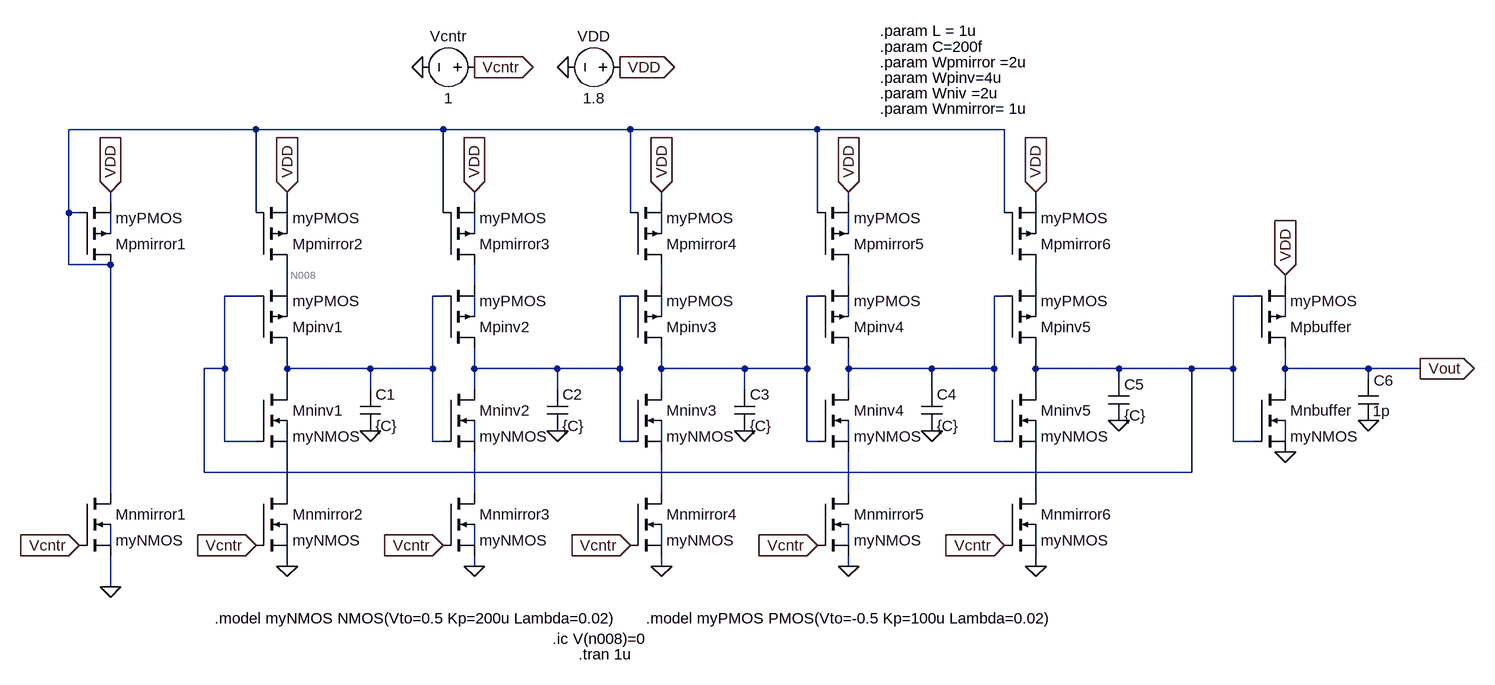
[diagram p0: schematic CMOS_Current-Starved_Voltage-Controlled_Oscillator_(VCO).asc]
CMOS_Current-Starved_Voltage-Controlled_Oscillator_(VCO).asc, the LTspice schematic file:
Version 4.1
SHEET 1 3616 680
WIRE 1712 -400 1424 -400
WIRE 2000 -400 1712 -400
WIRE 2288 -400 2000 -400
WIRE 2576 -400 2288 -400
WIRE 2864 -400 2576 -400
WIRE 1488 -288 1488 -304
WIRE 1760 -288 1760 -304
WIRE 2048 -288 2048 -304
WIRE 2336 -288 2336 -304
WIRE 2624 -288 2624 -304
WIRE 2912 -288 2912 -304
WIRE 1424 -272 1424 -400
WIRE 1440 -272 1424 -272
WIRE 1712 -272 1712 -400
WIRE 2000 -272 2000 -400
WIRE 2288 -272 2288 -400
WIRE 2576 -272 2576 -400
WIRE 2864 -272 2864 -400
WIRE 1488 -240 1488 -272
WIRE 1760 -240 1760 -272
WIRE 2048 -240 2048 -272
WIRE 2336 -240 2336 -272
WIRE 2624 -240 2624 -272
WIRE 2912 -240 2912 -272
WIRE 1424 -192 1424 -272
WIRE 1488 -192 1424 -192
WIRE 1760 -160 1760 -192
WIRE 2048 -160 2048 -192
WIRE 2336 -160 2336 -192
WIRE 2624 -160 2624 -192
WIRE 2912 -160 2912 -192
WIRE 3296 -160 3296 -176
WIRE 1712 -144 1664 -144
WIRE 2000 -144 1984 -144
WIRE 2288 -144 2272 -144
WIRE 2576 -144 2560 -144
WIRE 2864 -144 2848 -144
WIRE 3248 -144 3216 -144
WIRE 1760 -112 1760 -144
WIRE 2048 -112 2048 -144
WIRE 2336 -112 2336 -144
WIRE 2624 -112 2624 -144
WIRE 2912 -112 2912 -144
WIRE 3296 -112 3296 -144
WIRE 1664 -32 1664 -144
WIRE 1664 -32 1632 -32
WIRE 1760 -32 1760 -64
WIRE 1888 -32 1760 -32
WIRE 1984 -32 1984 -144
WIRE 1984 -32 1888 -32
WIRE 2048 -32 2048 -64
WIRE 2176 -32 2048 -32
WIRE 2272 -32 2272 -144
WIRE 2272 -32 2176 -32
WIRE 2336 -32 2336 -64
WIRE 2464 -32 2336 -32
WIRE 2560 -32 2560 -144
WIRE 2560 -32 2464 -32
WIRE 2624 -32 2624 -64
WIRE 2752 -32 2624 -32
WIRE 2848 -32 2848 -144
WIRE 2848 -32 2752 -32
WIRE 2912 -32 2912 -64
WIRE 3040 -32 2912 -32
WIRE 3152 -32 3040 -32
WIRE 3216 -32 3216 -144
WIRE 3216 -32 3152 -32
WIRE 3296 -32 3296 -64
WIRE 3424 -32 3296 -32
WIRE 3504 -32 3424 -32
WIRE 3040 -16 3040 -32
WIRE 3424 -16 3424 -32
WIRE 1760 0 1760 -32
WIRE 1888 0 1888 -32
WIRE 2048 0 2048 -32
WIRE 2176 0 2176 -32
WIRE 2336 0 2336 -32
WIRE 2464 0 2464 -32
WIRE 2624 0 2624 -32
WIRE 2752 0 2752 -32
WIRE 2912 0 2912 -32
WIRE 3296 0 3296 -32
WIRE 1664 80 1664 -32
WIRE 1712 80 1664 80
WIRE 1760 80 1760 48
WIRE 1984 80 1984 -32
WIRE 2000 80 1984 80
WIRE 2048 80 2048 48
WIRE 2272 80 2272 -32
WIRE 2288 80 2272 80
WIRE 2336 80 2336 48
WIRE 2560 80 2560 -32
WIRE 2576 80 2560 80
WIRE 2624 80 2624 48
WIRE 2848 80 2848 -32
WIRE 2864 80 2848 80
WIRE 2912 80 2912 48
WIRE 3216 80 3216 -32
WIRE 3248 80 3216 80
WIRE 3296 80 3296 48
WIRE 1632 128 1632 -32
WIRE 3152 128 3152 -32
WIRE 3152 128 1632 128
WIRE 1488 160 1488 -192
WIRE 1760 160 1760 96
WIRE 2048 160 2048 96
WIRE 2336 160 2336 96
WIRE 2624 160 2624 96
WIRE 2912 160 2912 96
WIRE 1488 240 1488 208
WIRE 1760 240 1760 208
WIRE 2048 240 2048 208
WIRE 2336 240 2336 208
WIRE 2624 240 2624 208
WIRE 2912 240 2912 208
WIRE 1760 272 1760 256
WIRE 2048 272 2048 256
WIRE 2336 272 2336 256
WIRE 2624 272 2624 256
WIRE 2912 272 2912 256
WIRE 1488 304 1488 256
FLAG 2192 -496 0
FLAG 2272 -496 VDD
IOPIN 2272 -496 Out
FLAG 1760 272 0
FLAG 1488 304 0
FLAG 1488 -304 VDD
IOPIN 1488 -304 In
FLAG 1760 -304 VDD
IOPIN 1760 -304 In
FLAG 1888 64 0
FLAG 1968 -496 0
FLAG 2048 -496 Vcntr
IOPIN 2048 -496 Out
FLAG 1440 240 Vcntr
IOPIN 1440 240 In
FLAG 1712 240 Vcntr
IOPIN 1712 240 In
FLAG 2048 -304 VDD
IOPIN 2048 -304 In
FLAG 2048 272 0
FLAG 2000 240 Vcntr
IOPIN 2000 240 In
FLAG 2176 64 0
FLAG 2336 -304 VDD
IOPIN 2336 -304 In
FLAG 2336 272 0
FLAG 2288 240 Vcntr
IOPIN 2288 240 In
FLAG 2464 64 0
FLAG 2624 -304 VDD
IOPIN 2624 -304 In
FLAG 2624 272 0
FLAG 2576 240 Vcntr
IOPIN 2576 240 In
FLAG 2752 64 0
FLAG 2912 -304 VDD
IOPIN 2912 -304 In
FLAG 2912 272 0
FLAG 2864 240 Vcntr
IOPIN 2864 240 In
FLAG 3040 48 0
FLAG 3296 96 0
FLAG 3296 -176 VDD
IOPIN 3296 -176 In
FLAG 3424 48 0
FLAG 3504 -32 Vout
IOPIN 3504 -32 Out
SYMBOL voltage 2288 -496 R90
WINDOW 0 -32 56 VBottom 2
WINDOW 3 32 56 VTop 2
WINDOW 123 0 0 Left 0
WINDOW 39 0 0 Left 0
SYMATTR InstName VDD
SYMATTR Value 1.8
SYMBOL nmos4 1440 160 R0
SYMATTR InstName Mnmirror1
SYMATTR Value myNMOS
SYMATTR Value2 l={L} w={Wnmirror}
SYMBOL pmos4 1440 -192 M180
SYMATTR InstName Mpmirror1
SYMATTR Value myPMOS
SYMATTR Value2 l={L} w={Wpmirror}
SYMBOL pmos4 1712 -192 M180
SYMATTR InstName Mpmirror2
SYMATTR Value myPMOS
SYMATTR Value2 l={L} w={Wpmirror}
SYMBOL pmos4 1712 -64 M180
SYMATTR InstName Mpinv1
SYMATTR Value myPMOS
SYMATTR Value2 l=1u w={Wpinv}
SYMBOL nmos4 1712 0 R0
SYMATTR InstName Mninv1
SYMATTR Value myNMOS
SYMATTR Value2 l=1u w={Wniv}
SYMBOL nmos4 1712 160 R0
SYMATTR InstName Mnmirror2
SYMATTR Value myNMOS
SYMATTR Value2 l={L} w={Wnmirror}
SYMBOL cap 1872 0 R0
SYMATTR InstName C1
SYMATTR Value {C}
SYMBOL voltage 2064 -496 R90
WINDOW 0 -32 56 VBottom 2
WINDOW 3 32 56 VTop 2
WINDOW 123 0 0 Left 0
WINDOW 39 0 0 Left 0
SYMATTR InstName Vcntr
SYMATTR Value 1
SYMBOL pmos4 2000 -64 M180
SYMATTR InstName Mpinv2
SYMATTR Value myPMOS
SYMATTR Value2 l=1u w={Wpinv}
SYMBOL nmos4 2000 0 R0
SYMATTR InstName Mninv2
SYMATTR Value myNMOS
SYMATTR Value2 l=1u w={Wniv}
SYMBOL pmos4 2000 -192 M180
SYMATTR InstName Mpmirror3
SYMATTR Value myPMOS
SYMATTR Value2 l={L} w={Wpmirror}
SYMBOL nmos4 2000 160 R0
SYMATTR InstName Mnmirror3
SYMATTR Value myNMOS
SYMATTR Value2 l={L} w={Wnmirror}
SYMBOL cap 2160 0 R0
SYMATTR InstName C2
SYMATTR Value {C}
SYMBOL pmos4 2288 -64 M180
SYMATTR InstName Mpinv3
SYMATTR Value myPMOS
SYMATTR Value2 l=1u w={Wpinv}
SYMBOL nmos4 2288 0 R0
SYMATTR InstName Mninv3
SYMATTR Value myNMOS
SYMATTR Value2 l=1u w={Wniv}
SYMBOL pmos4 2288 -192 M180
SYMATTR InstName Mpmirror4
SYMATTR Value myPMOS
SYMATTR Value2 l={L} w={Wpmirror}
SYMBOL nmos4 2288 160 R0
SYMATTR InstName Mnmirror4
SYMATTR Value myNMOS
SYMATTR Value2 l={L} w={Wnmirror}
SYMBOL cap 2448 0 R0
SYMATTR InstName C3
SYMATTR Value {C}
SYMBOL pmos4 2576 -64 M180
SYMATTR InstName Mpinv4
SYMATTR Value myPMOS
SYMATTR Value2 l=1u w={Wpinv}
SYMBOL nmos4 2576 0 R0
SYMATTR InstName Mninv4
SYMATTR Value myNMOS
SYMATTR Value2 l=1u w={Wniv}
SYMBOL pmos4 2576 -192 M180
SYMATTR InstName Mpmirror5
SYMATTR Value myPMOS
SYMATTR Value2 l={L} w={Wpmirror}
SYMBOL nmos4 2576 160 R0
SYMATTR InstName Mnmirror5
SYMATTR Value myNMOS
SYMATTR Value2 l={L} w={Wnmirror}
SYMBOL cap 2736 0 R0
SYMATTR InstName C4
SYMATTR Value {C}
SYMBOL pmos4 2864 -64 M180
SYMATTR InstName Mpinv5
SYMATTR Value myPMOS
SYMATTR Value2 l=1u w={Wpinv}
SYMBOL nmos4 2864 0 R0
SYMATTR InstName Mninv5
SYMATTR Value myNMOS
SYMATTR Value2 l=1u w={Wniv}
SYMBOL pmos4 2864 -192 M180
SYMATTR InstName Mpmirror6
SYMATTR Value myPMOS
SYMATTR Value2 l={L} w={Wpmirror}
SYMBOL nmos4 2864 160 R0
SYMATTR InstName Mnmirror6
SYMATTR Value myNMOS
SYMATTR Value2 l={L} w={Wnmirror}
SYMBOL cap 3024 -16 R0
SYMATTR InstName C5
SYMATTR Value {C}
SYMBOL pmos4 3248 -64 M180
SYMATTR InstName Mpbuffer
SYMATTR Value myPMOS
SYMATTR Value2 l=1u w=8u
SYMBOL nmos4 3248 0 R0
SYMATTR InstName Mnbuffer
SYMATTR Value myNMOS
SYMATTR Value2 l=1u w=4u
SYMBOL cap 3408 -16 R0
WINDOW 0 24 2 Left 2
WINDOW 3 23 49 Left 2
SYMATTR InstName C6
SYMATTR Value 1p
TEXT 1648 352 Left 2 !.model myNMOS NMOS(Vto=0.5 Kp=200u Lambda=0.02)
TEXT 2312 352 Left 2 !.model myPMOS PMOS(Vto=-0.5 Kp=100u Lambda=0.02)
TEXT 2208 408 Left 2 !.tran 1u
TEXT 2168 384 Left 2 !.ic V(n008)=0
TEXT 2672 -528 Left 2 !.param C=200f
TEXT 2672 -552 Left 2 !.param L = 1u
TEXT 2672 -456 Left 2 !.param Wniv =2u
TEXT 2672 -432 Left 2 !.param Wnmirror= 1u
TEXT 2672 -504 Left 2 !.param Wpmirror =2u
TEXT 2672 -480 Left 2 !.param Wpinv=4u

The netlist it stands for:
* CMOS_Current-Starved_Voltage-Controlled_Oscillator_(VCO).asc
VDD VDD 0 1.8
Mnmirror1 N001 Vcntr 0 N035 myNMOS l={L} w={Wnmirror}
Mpmirror1 N001 N001 VDD N002 myPMOS l={L} w={Wpmirror}
Mpmirror2 N008 N001 VDD N003 myPMOS l={L} w={Wpmirror}
Mpinv1 N014 N013 N008 N018 myPMOS l=1u w={Wpinv}
Mninv1 N014 N013 N030 N024 myNMOS l=1u w={Wniv}
Mnmirror2 N030 Vcntr 0 N036 myNMOS l={L} w={Wnmirror}
C1 N014 0 {C}
Vcntr Vcntr 0 1
Mpinv2 N015 N014 N009 N019 myPMOS l=1u w={Wpinv}
Mninv2 N015 N014 N031 N025 myNMOS l=1u w={Wniv}
Mpmirror3 N009 N001 VDD N004 myPMOS l={L} w={Wpmirror}
Mnmirror3 N031 Vcntr 0 N037 myNMOS l={L} w={Wnmirror}
C2 N015 0 {C}
Mpinv3 N016 N015 N010 N020 myPMOS l=1u w={Wpinv}
Mninv3 N016 N015 N032 N026 myNMOS l=1u w={Wniv}
Mpmirror4 N010 N001 VDD N005 myPMOS l={L} w={Wpmirror}
Mnmirror4 N032 Vcntr 0 N038 myNMOS l={L} w={Wnmirror}
C3 N016 0 {C}
Mpinv4 N017 N016 N011 N021 myPMOS l=1u w={Wpinv}
Mninv4 N017 N016 N033 N027 myNMOS l=1u w={Wniv}
Mpmirror5 N011 N001 VDD N006 myPMOS l={L} w={Wpmirror}
Mnmirror5 N033 Vcntr 0 N039 myNMOS l={L} w={Wnmirror}
C4 N017 0 {C}
Mpinv5 N013 N017 N012 N022 myPMOS l=1u w={Wpinv}
Mninv5 N013 N017 N034 N028 myNMOS l=1u w={Wniv}
Mpmirror6 N012 N001 VDD N007 myPMOS l={L} w={Wpmirror}
Mnmirror6 N034 Vcntr 0 N040 myNMOS l={L} w={Wnmirror}
C5 N013 0 {C}
Mpbuffer Vout N013 VDD N023 myPMOS l=1u w=8u
Mnbuffer Vout N013 0 N029 myNMOS l=1u w=4u
C6 Vout 0 1p
.model NMOS NMOS
.model PMOS PMOS
.lib standard.mos
.model myNMOS NMOS(Vto=0.5 Kp=200u Lambda=0.02)
.model myPMOS PMOS(Vto=-0.5 Kp=100u Lambda=0.02)
.tran 1u
.ic V(n008)=0
.param C=200f
.param L = 1u
.param Wniv =2u
.param Wnmirror= 1u
.param Wpmirror =2u
.param Wpinv=4u
.backanno
.end